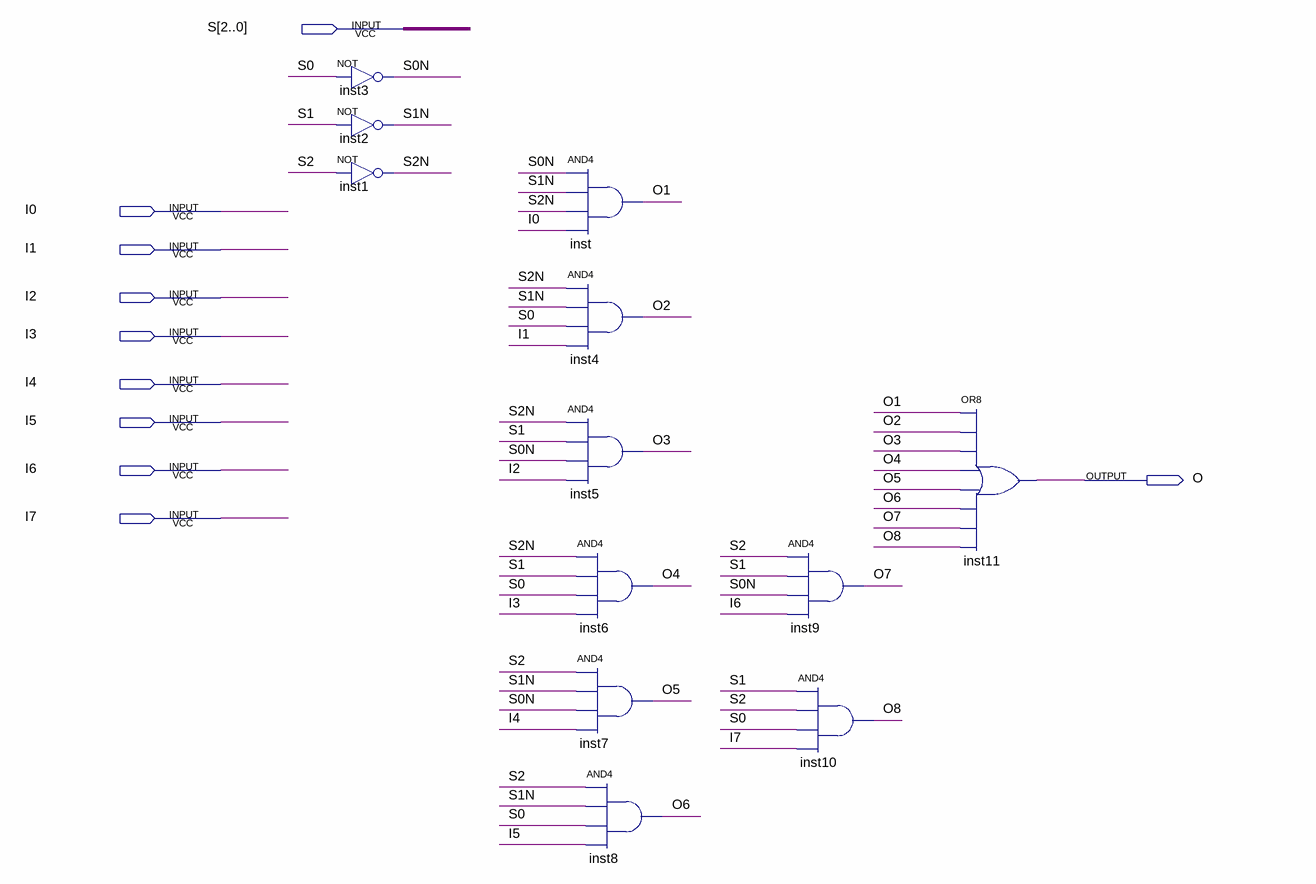
[diagram p0: schematic sheet]
// Quartus schematic MUX8_1.bdf as structural Verilog: 12 symbols, 10 pins
module MUX8_1 (
  input  [2:0] S,
  input  I0,
  input  I1,
  input  I2,
  input  I3,
  input  I4,
  input  I5,
  input  I6,
  input  I7,
  output O
);

  wire O1, O2, O3, O4, O5, O6, O7, O8, S0N, S1N, S2N;

  not inst3 (S0N, S[0]);
  not inst2 (S1N, S[1]);
  not inst1 (S2N, S[2]);
  and inst (O1, S0N, S1N, S2N, I0);
  and inst4 (O2, S2N, S1N, S[0], I1);
  and inst5 (O3, S2N, S[1], S0N, I2);
  and inst6 (O4, S2N, S[1], S[0], I3);
  and inst7 (O5, S[2], S1N, S0N, I4);
  and inst8 (O6, S[2], S1N, S[0], I5);
  and inst9 (O7, S[2], S[1], S0N, I6);
  and inst10 (O8, S[1], S[2], S[0], I7);
  or inst11 (O, O1, O2, O3, O4, O5, O6, O7, O8);
endmodule
